# EAGLE design optiMice_brkV2 (EAGLE 9.6.2)
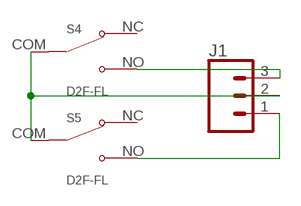
[diagram p0: schematic, sheet 1]

## Parts
J1  CONN_03JST-PTH-VERT  [JST-3-PTH-VERT]
S4  D2F-FL  [SW_D2F-FL]
S5  D2F-FL  [SW_D2F-FL]

## Nets
N$1: J1.2 S4.COM S5.COM
N$2: J1.3 S4.NO
N$3: J1.1 S5.NO
Unconnected: S4.NC S5.NC

## Library data of the parts
J1 = SparkFun-Connectors:CONN_03: Multi connection point. Often used as Generic Header-pin footprint for 0.1 inch spaced/style header connections On any of the 0.1 inch spaced packages, you can populate with these: Break Away Headers - Straight <https://www.sparkfun.com/products/116> (PRT-00116) Break Away Male Headers - Right Angle <https://www.sparkfun.com/products/553> (PRT-00553) Female Headers <https://www.sparkfun.com/products/115> (PRT-00115) Break Away Headers - Machine Pin <https://www.sparkfun.com/products/117> (PRT-00117) Break Away Female Headers - Swiss Machine Pin <https://www.sparkfun.com/products/743> (PRT-00743) Stackable Header - 3 Pin (Female, 0.1") <https://www.sparkfun.com/products/13875> (PRT-13875) For SCREWTERMINALS and SPRING TERMINALS visit here: Screw Terimnals on SparkFun.com <https://www.sparkfun.com/search/results?term=Screw+Terminals> (5mm/3.5mm/2.54mm spacing) This device is also useful as a general connection point to wire up your design to another part of your project. Our various solder wires solder well into these plated through hole pads. Hook-Up Wire - Assortment (Stranded, 22 AWG) <https://www.sparkfun.com/products/11375> (PRT-11375) Hook-Up Wire - Assortment (Solid Core, 22 AWG) <https://www.sparkfun.com/products/11367> (PRT-11367) View the entire wire category on our website here <https://www.sparkfun.com/categories/141> Special notes: Molex polarized connector foot print use with SKU : PRT-08232 with associated crimp pins and housings.; PROD_ID: CONN-13230
S4 S5 = D2F-FL:D2F-FL: SWITCH SNAP ACTION SPDT 1A 125V Check prices <https://pricing.snapeda.com/parts/D2F-FL/Omron%20Electronics/view-part?ref=eda>; AVAILABILITY: Good; DESCRIPTION: SWITCH SNAP ACTION SPDT 1A 125V; MF: Omron Electronics; MP: D2F-FL; PACKAGE: MQFP-44 Omron; PRICE: None; PURCHASE-URL: https://pricing.snapeda.com/search/part/D2F-FL/?ref=eda

## Board
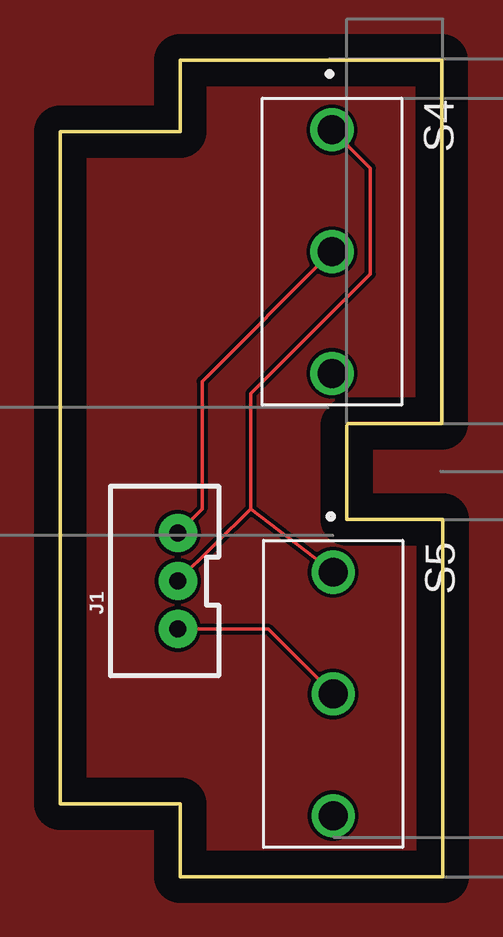
[diagram p1: board, top side]
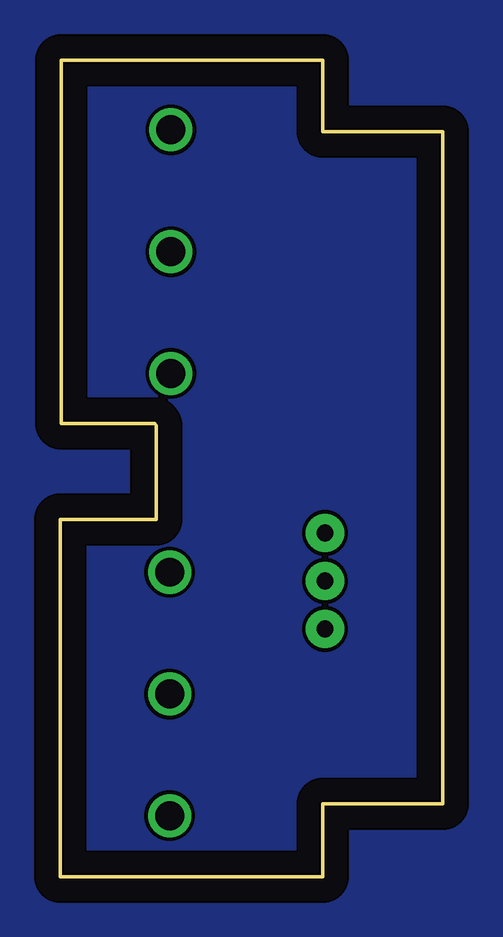
[diagram p2: board, bottom side, seen from below]

Size 15.95 x 34.05 mm. Coordinates in mm from the lower left corner, seen from the top.
Outline: 15.95,14.9 11.95,14.9 11.95,18.8 12,18.9 15.9,18.9 15.9,34.05 5,34.05 5,31.05 0,31.05 0,3.05 5,3.05 5,0 15.95,0 15.95,14.9
Copper layers (1*16): Top 0.035mm / dielectric 0.93mm / Bottom 0.035mm
Design rules "default": minimum track width 6mil, minimum drill 0.35mm, track to track 6mil, track to pad 6mil, pad to pad 6mil, via to via 6mil, smd to smd 6mil, copper to edge 40mil, drill to drill 6mil, minimum pad ring 10mil, minimum via ring 8mil, stop-mask expansion 4mil, vias tented up to drill 0mil, thermal gap 10mil

### Footprints (pad centres in the part's own frame; a part is rotated, then mirrored left to right if it is on the bottom)
JST-3-PTH-VERT = drill 0.7 pad 1.6: 1 -2,-0.55; 2 0,-0.55; 3 2,-0.55
SW_D2F-FL = drill 1.2: COM -5.08,0; NC 5.08,0; NO 0,0

### Placement (x,y rotation side)
J1  4.36,12.33 90 top
S4  11.33,26.06 270 top
S5  11.38,7.62 270 top

### Tracks (layer width: path | path; a pad name or v marks a point on that pad's centre or on a via)
GND
  pour Top: -21.3,38.9 28.45,38.9 28.45,-7.9 -15.5,-7.9 -21.35,-7.9 -21.35,38.9
  pour Bottom: 35.75,41.3 35.75,-7.85 -9.05,-7.85 -9.05,-6.95 -9.05,41.3 -8.25,41.3
N$1
  Top 0.152: S4.COM 12.93,29.54 12.93,25.13 7.95,20.15 7.95,15.33 | J1.2 7.95,15.33 | 7.95,15.33 S5.COM
N$2
  Top 0.152: S4.NO 5.92,20.65 5.92,15.34 J1.3
N$3
  Top 0.152: J1.1 8.67,10.33 S5.NO